# Altium schematic sheet schematic.SchDoc
size A3
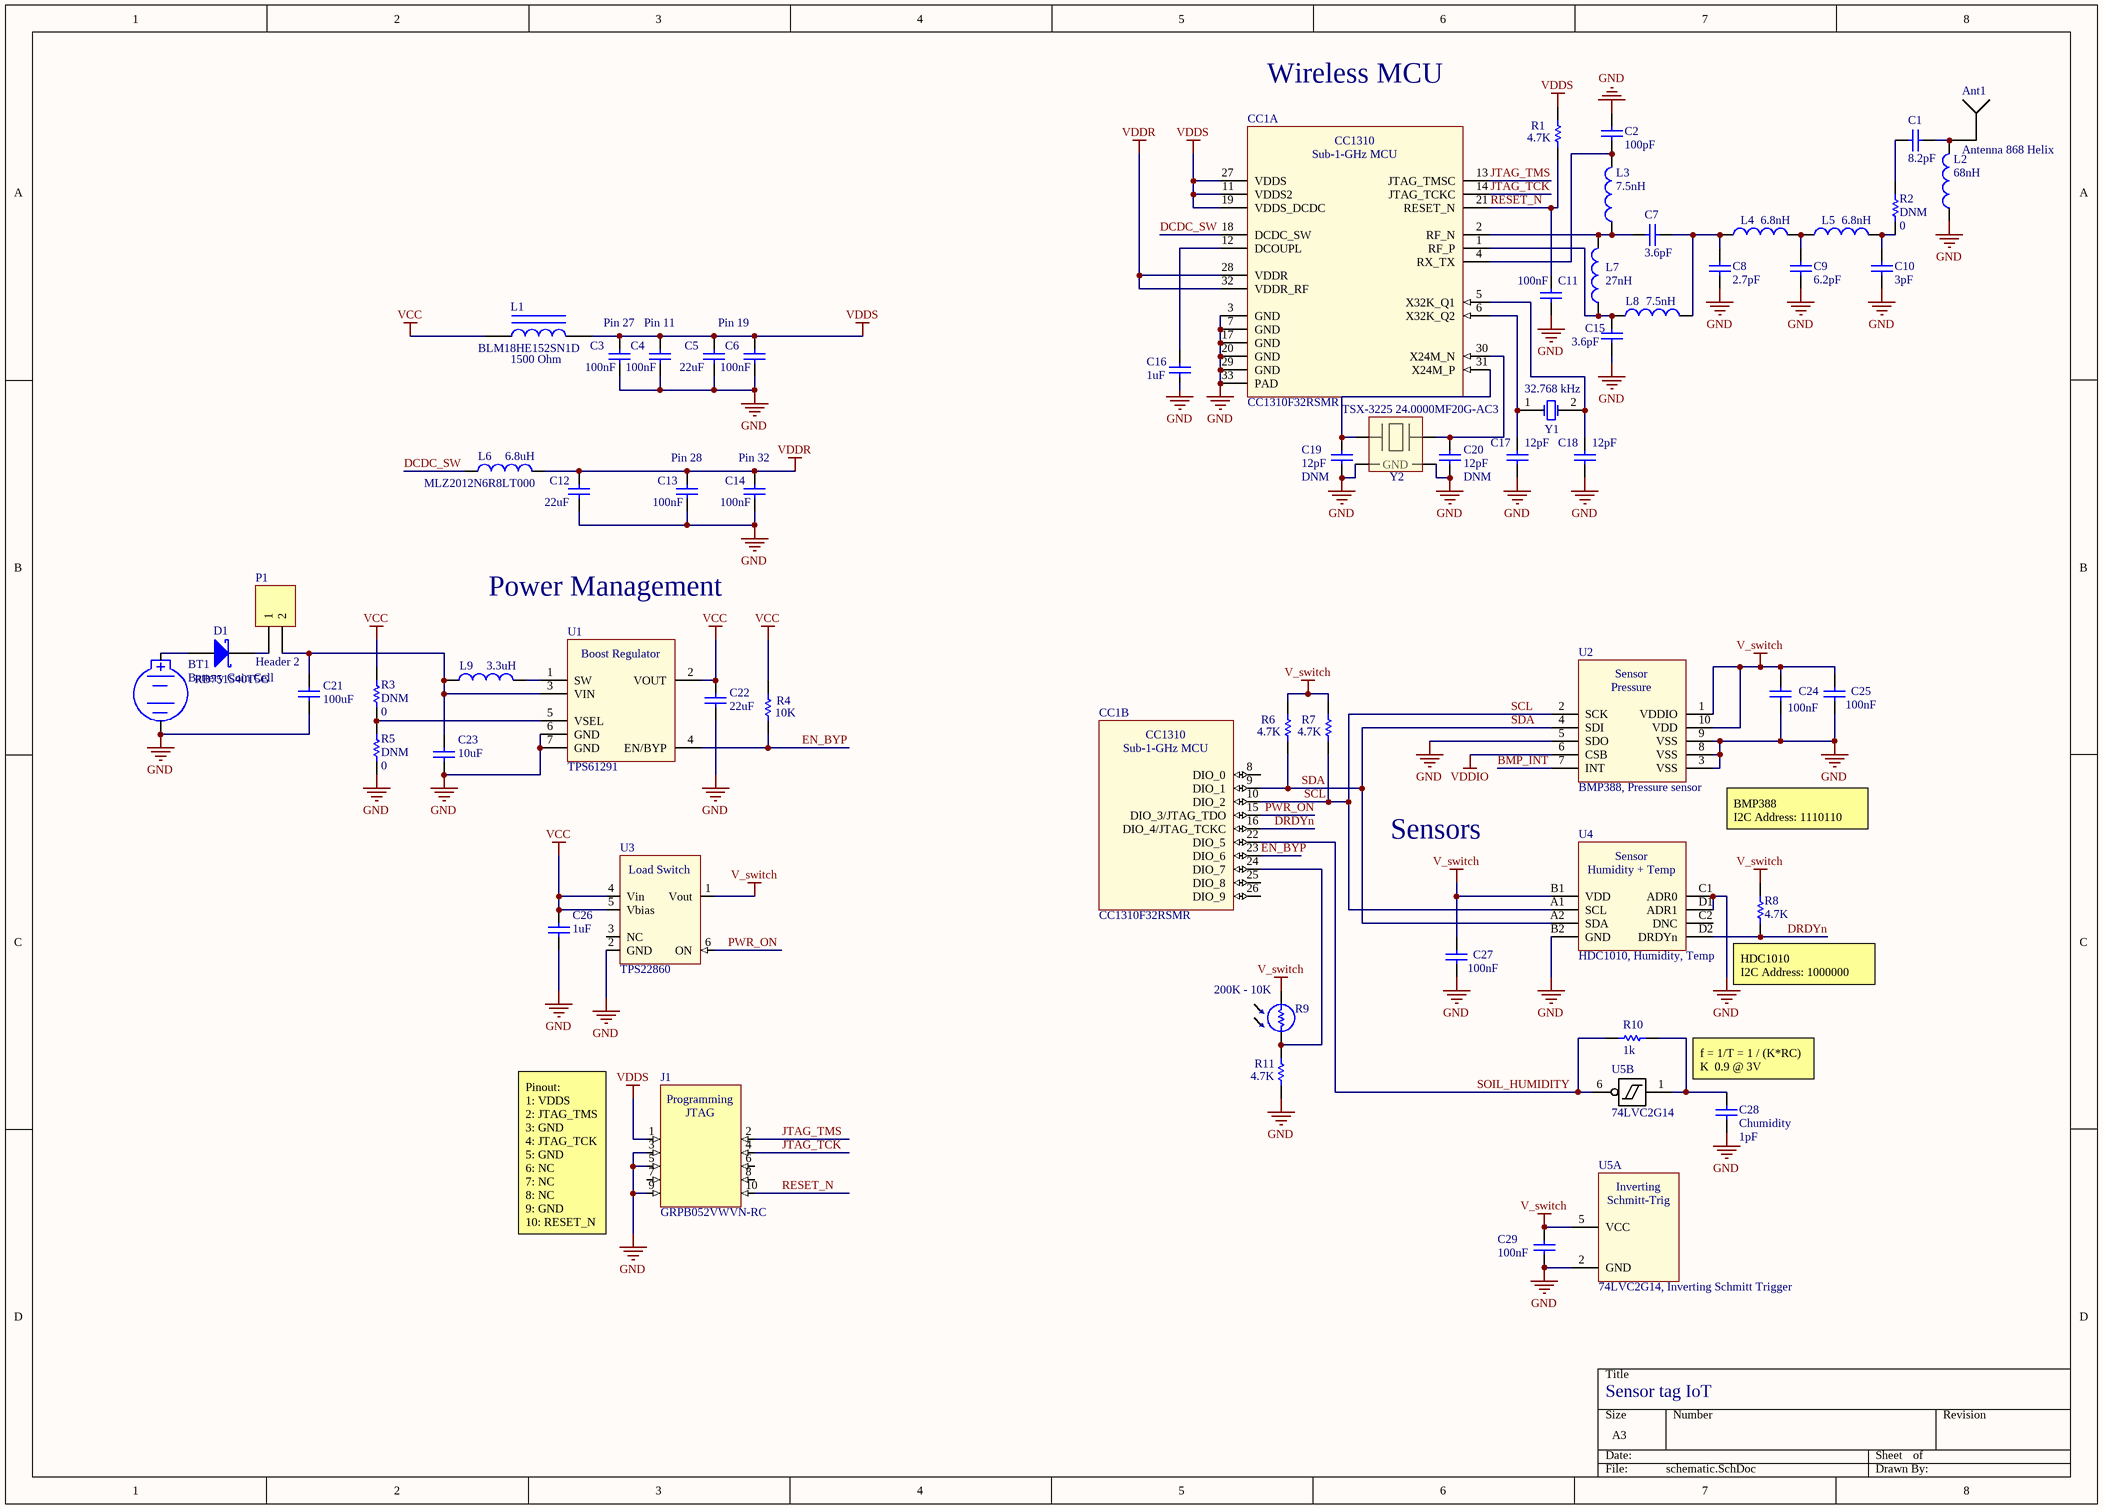
[diagram p0: schematic.SchDoc]

## Parts
Ant1  Antenna 868 Helix  [Antenna_868_Helix]
BT1  Battery Coin Cell  [S8421-45R]
C1  value 8.2pF  [0402 (CAP)]  (hidden comment: Cap)
C2  value 100pF  [0402 (CAP)]  (hidden comment: Cap)
C3  value 100nF  [0402 (CAP)]  (hidden comment: Cap)
C4  value 100nF  [0402 (CAP)]  (hidden comment: Cap)
C5  value 22uF  [0402 (CAP)]  (hidden comment: Cap)
C6  value 100nF  [0402 (CAP)]  (hidden comment: Cap)
C7  value 3.6pF  [0402 (CAP)]  (hidden comment: Cap)
C8  value 2.7pF  [0402 (CAP)]  (hidden comment: Cap)
C9  value 6.2pF  [0402 (CAP)]  (hidden comment: Cap)
C10  value 3pF  [0402 (CAP)]  (hidden comment: Cap)
C11  value 100nF  [0402 (CAP)]  (hidden comment: Cap)
C12  value 22uF  [0402 (CAP)]  (hidden comment: Cap)
C13  value 100nF  [0402 (CAP)]  (hidden comment: Cap)
C14  value 100nF  [0402 (CAP)]  (hidden comment: Cap)
C15  value 3.6pF  [0402 (CAP)]  (hidden comment: Cap)
C16  value 1uF  [0402 (CAP)]  (hidden comment: Cap)
C17  value 12pF  [0402 (CAP)]  (hidden comment: Cap)
C18  value 12pF  [0402 (CAP)]  (hidden comment: Cap)
C19  DNM  value 12pF  [0402 (CAP)]
C20  DNM  value 12pF  [0402 (CAP)]
C21  value 100uF  [1210 (CAP)]  (hidden comment: GRM32EC70J107ME15L)
C22  value 22uF  [0805 (CAP)]  (hidden comment: Cap)
C23  value 10uF  [0805 (CAP)]  (hidden comment: Cap)
C24  value 100nF  [0402 (CAP)]  (hidden comment: Cap)
C25  value 100nF  [0402 (CAP)]  (hidden comment: Cap)
C26  value 1uF  [0402 (CAP)]  (hidden comment: Cap)
C27  value 100nF  [0402 (CAP)]  (hidden comment: Cap)
C28  Chumidity  value 1pF  [Soil_Cap]
C29  value 100nF  [0402 (CAP)]  (hidden comment: Cap)
CC1  CC1310F32RSMR  [CC1310F32RSMR]  (parts A,B of 2)
D1  RB751S40T5G  [SOD-523]
J1  GRPB052VWVN-RC
L1  BLM18HE152SN1D  value 1500 Ohm  [0603 (IND)]
L2  value 68nH  [0603 (IND)]  (hidden comment: Inductor)
L3  value 7.5nH  [0402 (IND)]  (hidden comment: Inductor)
L4  value 6.8nH  [LQW15AN6N8G00D]  (hidden comment: Inductor)
L5  value 6.8nH  [LQW15AN6N8G00D]  (hidden comment: Inductor)
L6  MLZ2012N6R8LT000  value 6.8uH  [0805 (IND)]
L7  value 27nH  [0402 (IND)]  (hidden comment: Inductor)
L8  value 7.5nH  [0402 (IND)]  (hidden comment: Inductor)
L9  value 3.3uH  [SRN2009T]  (hidden comment: Inductor)
P1  Header 2  [HDR1X2]
R1  value 4.7K  [0402 (RES)]  (hidden comment: Res1)
R2  DNM  value 0  [0402 (RES)]
R3  DNM  value 0  [0402 (RES)]
R4  value 10K  [0402 (RES)]  (hidden comment: Res1)
R5  DNM  value 0  [0402 (RES)]
R6  value 4.7K  [0402 (RES)]  (hidden comment: Res1)
R7  value 4.7K  [0402 (RES)]  (hidden comment: Res1)
R8  value 4.7K  [0402 (RES)]  (hidden comment: Res1)
R9  200K - 10K  [Photoresistor]
R10  value 1k  [0402 (RES)]  (hidden comment: Rcharge)
R11  value 4.7K  [0402 (RES)]  (hidden comment: Res1)
U1  TPS61291  [TPS61291]
U2  BMP388, Pressure sensor  [BMP388]
U3  TPS22860  [SOT23-5]
U4  HDC1010, Humidity, Temp  [HDC1010]
U5  74LVC2G14, Inverting Schmitt Trigger  [74LVC2G14]  (parts A,B of 3)
Y1  32.768 kHz  [FC-12M 32.7680KA-A3]
Y2  TSX-3225 24.0000MF20G-AC3  [TSX-3225 24.0000MF20G-AC3]

## Nets
GND: BT1.2(Negative) C2.1 C3.1 C4.1 C5.1 C6.1 C8.2 C9.2 C10.2 C11.2 C12.1 C13.1 C14.1 C15.2 C16.1 C17.1 C18.1 C19.1 C20.1 C21.1 C22.1 C23.1 C24.1 C25.1 C26.1 C27.1 C28.2 C29.1 CC1.3(GND) CC1.7(GND) CC1.17(GND) CC1.20(GND) CC1.29(GND) CC1.33(PAD) J1.3(GND) J1.5(GND) J1.9(GND) L2.2 R5.2 R11.1 U1.6(GND) U1.7(GND) U2.3(VSS) U2.5(SDO) U2.8(VSS) U2.9(VSS) U3.2(GND) U4.B2(GND) U4.C1(ADR0) U4.D1(ADR1) U5.2(GND) Y2.2(ON) Y2.4(ON)
V_switch: C24.2 C25.2 C27.2 C29.2 R6.2 R7.2 R8.1 R9.1 U2.1(VDDIO) U2.10(VDD) U3.1(Vout) U4.B1(VDD) U5.5(VCC)
VCC: C22.2 C26.2 L1.1 R3.1 R4.1 U1.2(VOUT) U3.4(Vin) U3.5(Vbias)
VDDIO: U2.6(CSB)
VDDR: C12.2 C13.2 C14.2 CC1.28(VDDR) CC1.32(VDDR_RF) L6.2
VDDS: C3.2 C4.2 C5.2 C6.2 CC1.11(VDDS2) CC1.19(VDDS_DCDC) CC1.27(VDDS) J1.1(VDDS) L1.2 R1.2
BMP_INT: U2.7(INT)
DCDC_SW: CC1.18(DCDC_SW) L6.1
DRDYn: CC1.16(DIO_4/JTAG_TCKC) R8.2 U4.D2(DRDYn)
EN_BYP: CC1.23(DIO_6) R4.2 U1.4(EN/BYP)
JTAG_TCK: CC1.14(JTAG_TCKC) J1.4(JTAG_TCK)
JTAG_TMS: CC1.13(JTAG_TMSC) J1.2(JTAG_TMS)
PWR_ON: CC1.15(DIO_3/JTAG_TDO) U3.6(ON)
RESET_N: C11.1 CC1.21(RESET_N) J1.10(RESET_N) R1.1
SCL: CC1.10(DIO_2) R7.1 U2.2(SCK) U4.A1(SCL)
SDA: CC1.9(DIO_1) R6.1 U2.4(SDI) U4.A2(SDA)
SOIL_HUMIDITY: CC1.22(DIO_5) R10.2 U5.6(1Y)
NetAnt1_1: Ant1.1 C1.2 L2.1
NetBT1_1: BT1.1(Positive) D1.1(A)
NetC1_1: C1.1 R2.1
NetC2_2: C2.2 CC1.4(RX_TX) L3.2
NetC7_1: C7.1 CC1.2(RF_N) L3.1 L7.1
NetC7_2: C7.2 C8.1 L4.2 L8.1
NetC9_1: C9.1 L4.1 L5.2
NetC10_1: C10.1 L5.1 R2.2
NetC15_1: C15.1 CC1.1(RF_P) L7.2 L8.2
NetC16_2: C16.2 CC1.12(DCOUPL)
NetC17_2: C17.2 CC1.6(X32K_Q2) Y1.1(OSC1)
NetC18_2: C18.2 CC1.5(X32K_Q1) Y1.2(OSC2)
NetC19_2: C19.2 CC1.31(X24M_P) Y2.1(ON)
NetC20_2: C20.2 CC1.30(X24M_N) Y2.3(ON)
NetC21_2: C21.2 C23.2 L9.1 P1.2 U1.3(VIN)
NetC28_1: C28.1 R10.1 U5.1(1A)
NetCC1_24: CC1.24(DIO_7) R9.2 R11.2
NetD1_2: D1.2(K) P1.1
NetL9_2: L9.2 U1.1(SW)
NetR3_2: R3.2 R5.1 U1.5(VSEL)

Not connected (* = marked no-connect by the designer): CC1 8(DIO_0) 25(DIO_8) 26(DIO_9); J1 6(NC) 7(NC) 8(NC); U3 3(NC); U4 C2(DNC)

## Notes on the sheet
- Wireless MCU
- Pin 27
- Pin 11
- Pin 19
- (near C13) Pin 28
- (near C14) Pin 32
- Power Management
- Sensors
- BMP388
  I2C Address: 1110110
- (near R8) HDC1010
  I2C Address: 1000000
- (near C28) f = 1/T = 1 / (K*RC)
  K  0.9 @ 3V
- Pinout:
  1: VDDS
  2: JTAG_TMS
  3: GND
  4: JTAG_TCK
  5: GND
  6: NC
  7: NC
  8: NC
  9: GND
  10: RESET_N
- Sensor tag IoT
- (in symbol 74LVC2G14, part A) Inverting; Schmitt-Trig
- (in symbol BMP388) Sensor; Pressure
- (in symbol CC1310F32RSMR, part A) CC1310; Sub-1-GHz MCU
- (in symbol CC1310F32RSMR, part B) CC1310; Sub-1-GHz MCU
- (in symbol Crystal) GND
- (in symbol GRPB052VWVN-RC) Programming; JTAG
- (in symbol HDC1010) Sensor; Humidity + Temp
- (in symbol TPS22860) Load Switch
- (in symbol TPS61291) Boost Regulator

## Library data of the parts
C1-C29 = Cap: Capacitor; Published: 8-Jun-2000; LatestRevisionDate: 17-Jul-2002; LatestRevisionNote: Re-released for DXP Platform.; PackageReference: RAD-0.3; Publisher: Altium Limited; PackageDescription: Radial Cap, Thru-Hole; 2 Leads; 0.3 in Pin Spacing
D1 = D Schottky: Schottky Diode; Published: 8-Jun-2000; LatestRevisionDate: 17-Jul-2002; LatestRevisionNote: Re-released for DXP Platform.; PackageReference: SMB; Publisher: Altium Limited; PackageDescription: DO-214-AA/SMB; 2 C-Bend Leads; Body 5.3 x 3.6 mm, inc. leads (LxW); Code_JEDEC: DO-214-AA
L1 = Inductor Iron: Magnetic-Core Inductor; Published: 24-Mar-1999; LatestRevisionDate: 17-Jul-2002; LatestRevisionNote: Re-released for DXP Platform.; PackageReference: AXIAL-0.9; Publisher: Altium Limited; PackageDescription: Axial Device, Thru-Hole; 2 Leads; 0.9 in Pin Spacing
L2-L9 = Inductor: Code_IEC: 1005; Published: 8-Jun-2000; LatestRevisionDate: 29-May-2009; LatestRevisionNote: IPC-7351 Footprint Added.; PackageReference: 0402-A; Publisher: Altium Limited; PackageDescription: Chip Inductor; Code_JEITA: 0402
P1 = Header 2: Header, 2-Pin; LatestRevisionDate: 17-Jul-2002; LatestRevisionNote: Re-released for DXP Platform.; Publisher: Altium Limited
R1-R8 R10 R11 = Res1: Resistor; Published: 8-Jun-2000; LatestRevisionDate: 17-Jul-2002; LatestRevisionNote: Re-released for DXP Platform.; PackageReference: AXIAL-0.3; Publisher: Altium Limited; PackageDescription: Axial Device, Thru-Hole; 2 Leads; 0.3 in Pin Spacing
R9 = Photo Resistor
U2 = BMP388
U4 = HDC1010
U5 = 74LVC2G14
Y1 = XTAL: Crystal Oscillator; Published: 8-Jun-2000; LatestRevisionDate: 17-Jul-2002; LatestRevisionNote: Re-released for DXP Platform.; PackageReference: R38; Publisher: Altium Limited; PackageDescription: Crystal, Thru-Hole; 2 Leads; Body 3.1 x 8.2 mm (Dia.xH)
Y2 = Crystal